# Altium schematic sheet Humidifier.SchDoc
size A2; PageSetup: Record=PageOptions|CenterHorizontal=True|CenterVertical=True|PrintScale=1.00|XCorrection=1.00|YCorrection=1.00|PrintKind=0|BorderSize=5000000|LeftOffset=0|BottomOffset=0|Orientation=2|PaperLength=1000|PaperWidth=1000|Scale=100|PaperSource=7|PrintQuality=-4|MediaType=1|DitherType=10|PaperKind=A4|PrintScaleMode=1
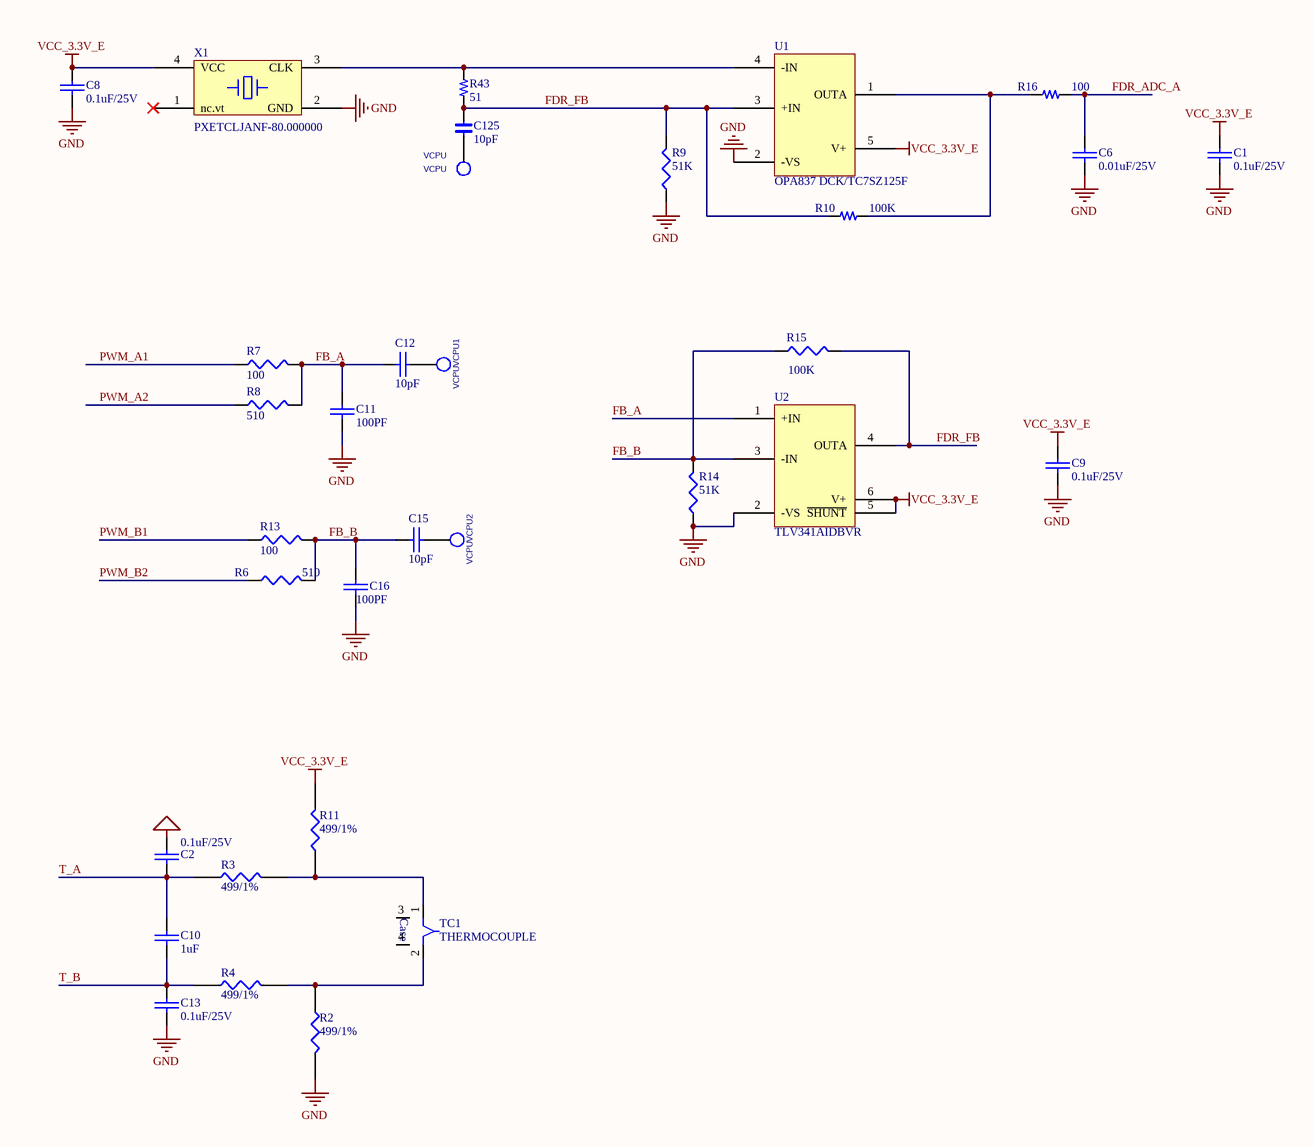
[diagram p0: Humidifier.SchDoc]

## Parts
C1  0.1uF/25V  [0603C]
C2  0.1uF/25V  [0603c]
C6  0.01uF/25V  [0603C]
C8  0.1uF/25V  [0603C]
C9  0.1uF/25V  [0603C]
C10  1uF  [0603c]
C11  100PF  [0603C]
C12  10pF  [0603C]
C13  0.1uF/25V  [0603c]
C15  10pF  [0603C]
C16  100PF  [0603C]
C125  10pF  [0603C]
R2  499/1%  [0603r]
R3  499/1%  [0603r]
R4  499/1%  [0603r]
R6  510  [0603R]
R7  100  [0603R]
R8  510  [0603R]
R9  51K  [0603R]
R10  100K  [0603R]
R11  499/1%  [0603r]
R13  100  [0603R]
R14  51K  [0603R]
R15  100K  [0603R]
R16  100  [0603R]
R43  51  [0603r]
TC1  THERMOCOUPLE  [0603R]
U1  OPA837 DCK/TC7SZ125F  [SC70-5]
U2  TLV341AIDBVR  [SOT-23-6]
VCPU  VCPU  [probe]
VCPU1  VCPU  [probe]
VCPU2  VCPU  [probe]
X1  PXETCLJANF-80.000000  [XTAL4TN_7050]

## Nets
GND: C1.1 C2.2 C6.1 C8.2 C9.1 C11.2 C13.2 C16.2 R2.2 R9.1 R14.1 U1.2(-VS) U2.2(-VS) X1.2(GND)
VCC_3.3V_E: C1.2 C8.1 C9.2 R11.2 U1.5(V+) U2.5(~{SHUNT}) U2.6(V+) X1.4(VCC)
FB_A: C11.1 C12.2 R7.2 R8.2 U2.1(+IN)
FB_B: C15.1 C16.1 R6.2 R13.2 R14.2 R15.1 U2.3(-IN)
FDR_ADC_A: C6.2 R16.2
FDR_FB: C125.1 R9.2 R10.1 R15.2 R43.2 U1.3(+IN) U2.4(OUTA)
PWM_A1: R7.1
PWM_A2: R8.1
PWM_B1: R13.1
PWM_B2: R6.1
T_A: C2.1 C10.1 R3.1
T_B: C10.2 C13.1 R4.1
NetC12_1: C12.1 VCPU1.1(TP)
NetC15_2: C15.2 VCPU2.1(TP)
NetC125_2: C125.2 VCPU.1(TP)
NetR2_1: R2.1 R4.2 TC1.2
NetR3_2: R3.2 R11.1 TC1.1
NetR10_2: R10.2 R16.1 U1.1(OUTA)
NetR43_1: R43.1 U1.4(-IN) X1.3(CLK)

Not connected (* = marked no-connect by the designer): TC1 3 4; X1 1(nc.vt)*

## Notes on the sheet
- (in symbol THERMOCOUPLE) Case

## Library data of the parts
C1 C2 C6 C8-C13 C15 C16 = CAP: Capacitor
C125 = C
R2-R4 R11 = RES1
R6-R9 R13-R15 = Res3: Resistor; Published: 8-Jun-2000; LatestRevisionDate: 29-May-2009; LatestRevisionNote: IPC-7351 Footprint Added.; PackageReference: J1-0603; Publisher: Altium Limited; PackageDescription: Chip Resistor
R10 R16 R43 = R
U1 = OPA837 DCK
VCPU VCPU1 VCPU2 = T_POINT_R
X1 = XTAL4S